# EAGLE design shield (EAGLE 9.6.2)
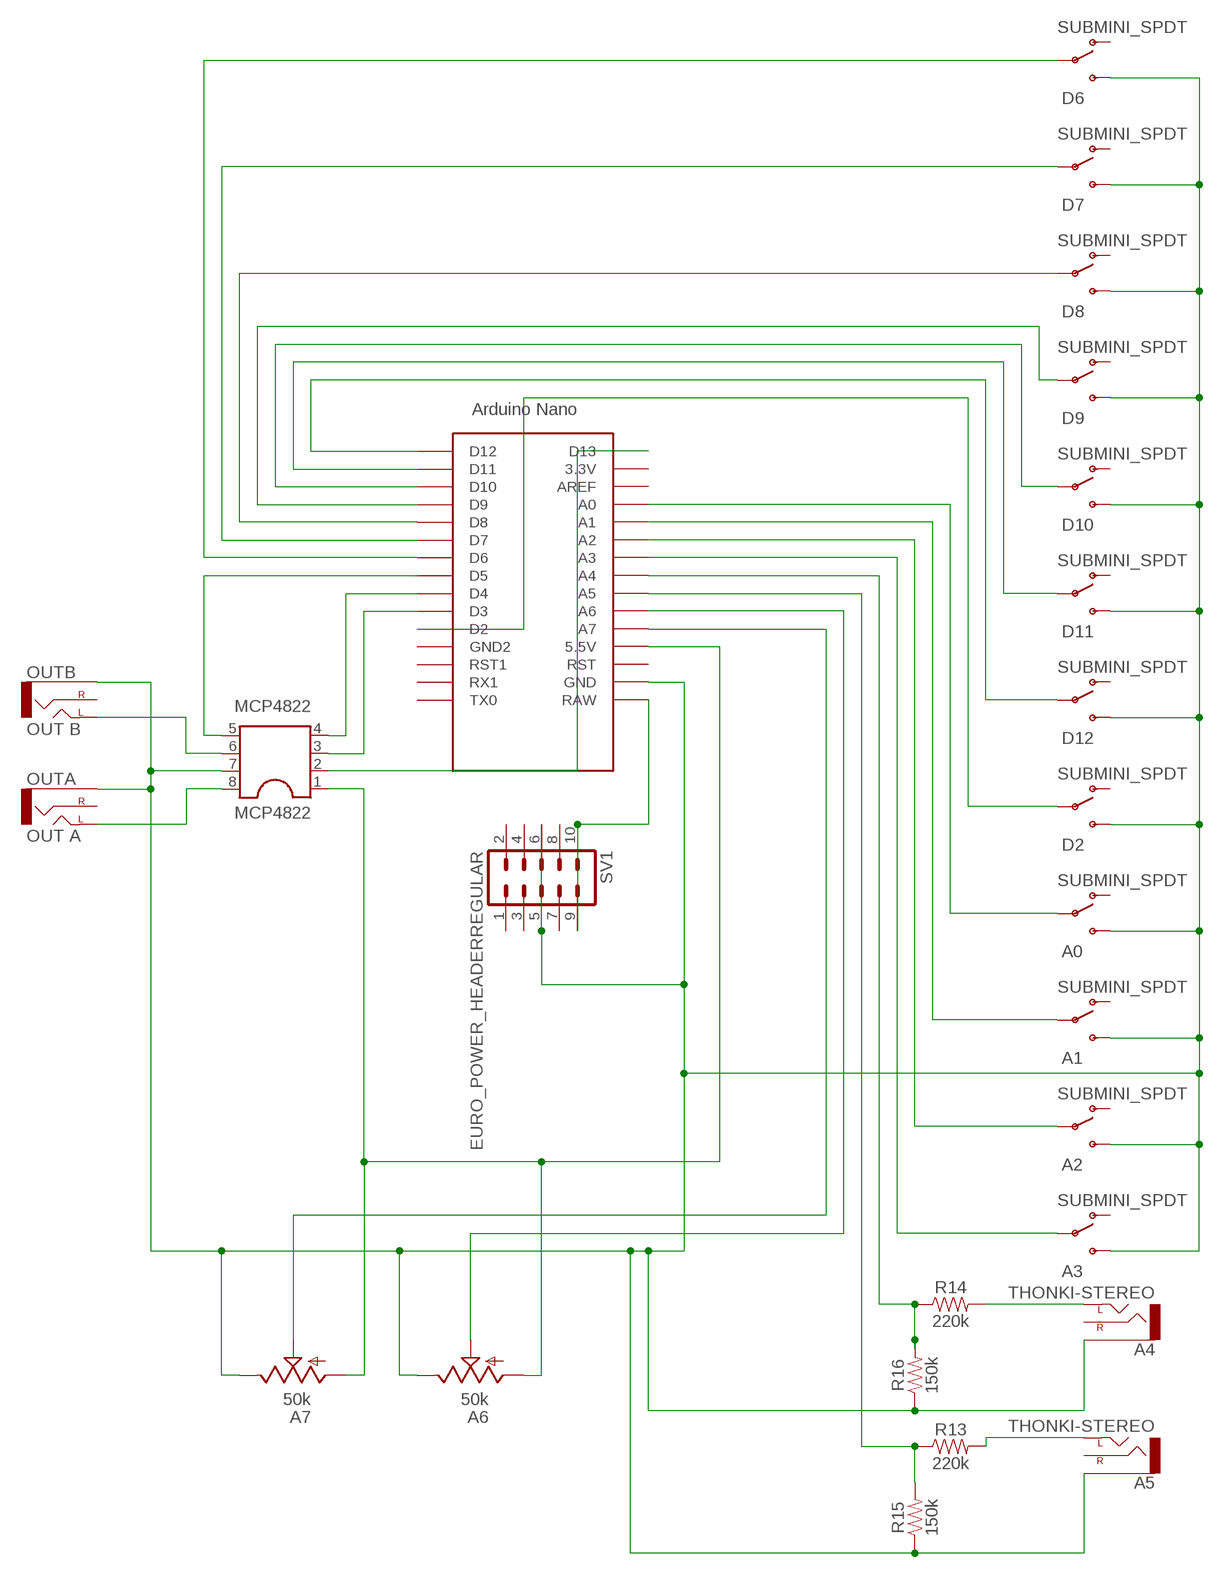
[diagram p0: schematic, sheet 1]

## Parts
A0  SUBMINI_SPDT  [SUBMINI_TOGGLE]
A1  SUBMINI_SPDT  [SUBMINI_TOGGLE]
A2  SUBMINI_SPDT  [SUBMINI_TOGGLE]
A3  SUBMINI_SPDT  [SUBMINI_TOGGLE]
A4  THONKI-STEREO  [WQP-PJ366ST_JACK]
A5  THONKI-STEREO  [WQP-PJ366ST_JACK]
A6  50k  9MM_SNAP-IN_POT_  [9MM_SNAP-IN_POT]
A7  50k  9MM_SNAP-IN_POT_  [9MM_SNAP-IN_POT]
D2  SUBMINI_SPDT  [SUBMINI_TOGGLE]
D6  SUBMINI_SPDT  [SUBMINI_TOGGLE]
D7  SUBMINI_SPDT  [SUBMINI_TOGGLE]
D8  SUBMINI_SPDT  [SUBMINI_TOGGLE]
D9  SUBMINI_SPDT  [SUBMINI_TOGGLE]
D10  SUBMINI_SPDT  [SUBMINI_TOGGLE]
D11  SUBMINI_SPDT  [SUBMINI_TOGGLE]
D12  SUBMINI_SPDT  [SUBMINI_TOGGLE]
MCP4822  MCP4822  DIL8  [DIL08]
OUTA  OUT A  THONKI-STEREO  [WQP-PJ366ST_JACK]
OUTB  OUT B  THONKI-STEREO  [WQP-PJ366ST_JACK]
R13  220k  10KOHM-HORIZ-1/4W-5%  [AXIAL-0.3]
R14  220k  10KOHM-HORIZ-1/4W-5%  [AXIAL-0.3]
R15  150k  10KOHM-HORIZ-1/4W-5%  [AXIAL-0.3]
R16  150k  10KOHM-HORIZ-1/4W-5%  [AXIAL-0.3]
SV1  EURO_POWER_HEADERREGULAR  [EURO_POWER_HEADER]
U$1  NANO  [NANO]

## Nets
N$1: SV1.9 SV1.10 U$1.RAW
N$2: A6.2(S) U$1.A6
N$3: A6.1(A) A7.1(A) MCP4822.1 U$1.5V(5.5V)
N$4: D6.COM(COMMON) U$1.D6
N$5: D7.COM(COMMON) U$1.D7
N$6: A7.2(S) U$1.A7
N$7: D9.COM(COMMON) U$1.D9
N$8: D10.COM(COMMON) U$1.D10
N$9: D11.COM(COMMON) U$1.D11
N$10: D12.COM(COMMON) U$1.D12
N$11: D2.COM(COMMON) U$1.D2
N$12: A0.COM(COMMON) U$1.A0
N$13: A1.COM(COMMON) U$1.A1
N$14: A2.COM(COMMON) U$1.A2
N$15: A3.COM(COMMON) U$1.A3
N$17: MCP4822.8 OUTA.P$1_TIP(LEFT)
N$18: MCP4822.6 OUTB.P$1_TIP(LEFT)
N$19: MCP4822.2 U$1.D13
N$20: MCP4822.3 U$1.D3
N$21: MCP4822.4 U$1.D4
N$22: MCP4822.5 U$1.D5
N$23: A0.3(S) A1.3(S) A2.3(S) A3.3(S) A4.P$3_SLEEVE(SLEEVE) A5.P$3_SLEEVE(SLEEVE) A6.3(E) A7.3(E) D2.3(S) D6.3(S) D7.3(S) D8.3(S) D9.3(S) D10.3(S) D11.3(S) D12.3(S) MCP4822.7 OUTA.P$3_SLEEVE(SLEEVE) OUTB.P$3_SLEEVE(SLEEVE) R15.P$1 R16.P$1 SV1.5 SV1.6 U$1.GND
N$24: D8.COM(COMMON) U$1.D8
N$25: A5.P$1_TIP(LEFT) R13.P$2
N$26: A4.P$1_TIP(LEFT) R14.P$2
N$29: R14.P$1 R16.P$2 U$1.A4
N$30: R13.P$1 R15.P$2 U$1.A5
Unconnected: A0.1(O) A1.1(O) A2.1(O) A3.1(O) A4.P$2_SWITCH(RIGHT) A5.P$2_SWITCH(RIGHT) D2.1(O) D6.1(O) D7.1(O) D8.1(O) D9.1(O) D10.1(O) D11.1(O) D12.1(O) OUTA.P$2_SWITCH(RIGHT) OUTB.P$2_SWITCH(RIGHT) SV1.1 SV1.2 SV1.3 SV1.4 SV1.7 SV1.8 U$1.3.3V U$1.AREF U$1.GND1(GND2) U$1.ICSP1 U$1.ICSP2 U$1.ICSP3 U$1.ICSP4 U$1.ICSP5 U$1.ICSP6 U$1.RST U$1.RST1 U$1.RX1 U$1.TX0

## Library data of the parts
A0 A1-A3 D2 D6-D12 = MusicThingModular:SUBMINI_SPDT
A4 A5 OUTA OUTB = MusicThingModular:THONKI-STEREO: 3.5mm socket for Eurorack modular synths
A6 A7 = MusicThingModular:9MM_SNAP-IN_POT: 9mm vertical snap-in pot, Alpha / Panasonic style
MCP4822 = ic-package:DIL8: Dual In Line / Socket
R13-R16 = SparkFun-Resistors:10KOHM: 10kΩ resistor A resistor is a passive two-terminal electrical component that implements electrical resistance as a circuit element. Resistors act to reduce current flow, and, at the same time, act to lower voltage levels within circuits. - Wikipedia; PROD_ID: RES-09435; VALUE: 10k
SV1 = MusicThingModular:EURO_POWER_HEADER: Power Header 10 pin power header for Eurorack Power Supplies Variants with fatter pads for easier soldering, and the LOCK variant which has 5mil offset pins to hold the component in place before soldering
U$1 = Arduino-clone:NANO: Arduino Nano

## Board
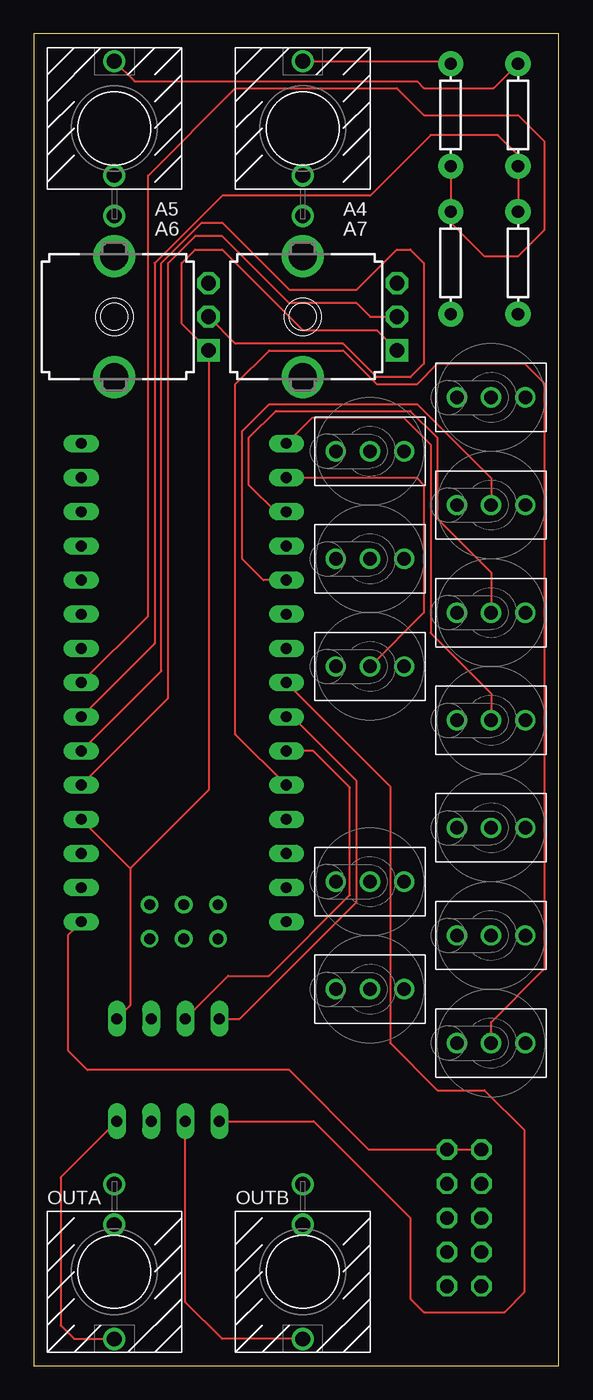
[diagram p1: board, top side]
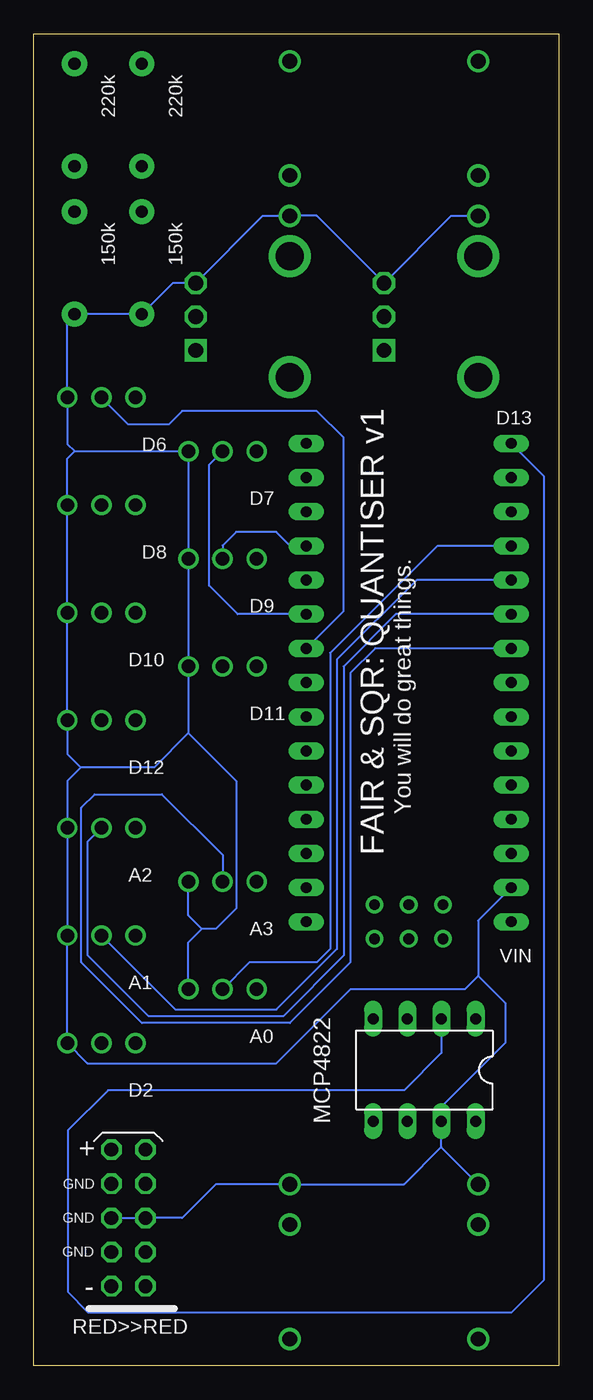
[diagram p2: board, bottom side, seen from below]

Size 39.04 x 99.05 mm. Coordinates in mm from the lower left corner, seen from the top.
Outline: 0,0 39.04,0 39.04,99.05 0,99.05 0,0
Copper layers (1*16): Top 0.035mm / dielectric 1.5mm / Bottom 0.035mm
Design rules "default": minimum track width 6mil, minimum drill 0.35mm, track to track 6mil, track to pad 6mil, pad to pad 6mil, via to via 6mil, smd to smd 6mil, copper to edge 40mil, drill to drill 6mil, minimum pad ring 10mil, minimum via ring 8mil, stop-mask expansion 4mil, vias tented up to drill 0mil, thermal gap 10mil

### Footprints (pad centres in the part's own frame; a part is rotated, then mirrored left to right if it is on the bottom)
SUBMINI_TOGGLE = drill 1 pad 1.422: 1 -2.54,0; 3 2.54,0; COM 0,0
WQP-PJ366ST_JACK = drill 1.1: P$1_TIP 0,5; P$2_SWITCH 0,-3.5; P$3_SLEEVE 0,-6.5
9MM_SNAP-IN_POT = drill 1.1 square: 1 -2.5,-7 | drill 1.1 octagon: 2 0,-7; 3 2.5,-7 | drill 2.1 pad 2.794: CHASSIS1 -4.5,0; CHASSIS2 4.5,0
DIL08 = drill 0.813 long: 1 -3.81,-3.81; 2 -1.27,-3.81; 3 1.27,-3.81; 4 3.81,-3.81; 5 3.81,3.81; 6 1.27,3.81; 7 -1.27,3.81; 8 -3.81,3.81
AXIAL-0.3 = drill 0.9 pad 1.88: P$1 -3.81,0; P$2 3.81,0
EURO_POWER_HEADER = drill 1.016 octagon: 1 -5.08,-1.27; 2 -5.08,1.27; 3 -2.54,-1.27; 4 -2.54,1.27; 5 0,-1.27; 6 0,1.27; 7 2.54,-1.27; 8 2.54,1.27; 9 5.08,-1.27; 10 5.08,1.27
NANO = drill 0.8 long: 3.3V -10.16,24.13; 5V -10.16,-1.27; A0 -10.16,19.05; A1 -10.16,16.51; A2 -10.16,13.97; A3 -10.16,11.43; A4 -10.16,8.89; A5 -10.16,6.35; A6 -10.16,3.81; A7 -10.16,1.27; AREF -10.16,21.59; D2 5.08,1.27; D3 5.08,3.81; D4 5.08,6.35; D5 5.08,8.89; D6 5.08,11.43; D7 5.08,13.97; D8 5.08,16.51; D9 5.08,19.05; D10 5.08,21.59; D11 5.08,24.13; D12 5.08,26.67; D13 -10.16,26.67; GND -10.16,-6.35; GND1 5.08,-1.27; RAW -10.16,-8.89; RST -10.16,-3.81; RST1 5.08,-3.81; RX1 5.08,-6.35; TX0 5.08,-8.89 | drill 0.8: ICSP1 -5.08,-10.16; ICSP2 -5.08,-7.62; ICSP3 -2.54,-10.16; ICSP4 -2.54,-7.62; ICSP5 0,-10.16; ICSP6 0,-7.62

### Placement (x,y rotation side)
A0  25,28 0 top
A1  34,32 0 top
A2  34,40 0 top
A3  25,36 0 top
A4  20,92 0 top
A5  6,92 0 top
A6  6,78 90 top
A7  20,78 90 top
D2  34,24 0 top
D6  34,72 0 top
D7  25,68 0 top
D8  34,64 0 top
D9  25,60 0 top
D10  34,56 0 top
D11  25,52 0 top
D12  34,48 0 top
MCP4822  10,22 180 bottom
OUTA  6,7 180 top
OUTB  20,7 180 top
R13  36,93 90 top
R14  31,93 90 top
R15  36,82 90 top
R16  31,82 90 top
SV1  32,11 90 bottom
U$1  13.7,41.91 0 top

### Tracks (layer width: path | path; a pad name or v marks a point on that pad's centre or on a via)
N$1
  Top 0.152: SV1.10 SV1.9 24.92,16.08 19,22 4,22 2.54,23.46 2.54,32.02 U$1.RAW
N$2
  Top 0.152: U$1.A6 9.5,51.68 9.5,82 12.5,85 14,85 19,80 24,80 27,83 28,83 29,82 29,74.5 28,73.5 25.5,73.5 23,76 15,76 A6.2
N$3
  Top 0.152: MCP4822.1 7.19,26.81 7.19,36.99 | 7.19,36.99 U$1.5V | 7.19,36.99 13,42.8 A6.1 11,77.5 11,82 12,83 14,83 20,77 25.5,77 A7.1
N$4
  Bottom 0.152: U$1.D6 16,56.12 16,69 18,71 28,71 29,70 32,70 D6.COM
N$5
  Bottom 0.152: U$1.D7 23.88,55.88 26,58 26,67 D7.COM
N$6
  Top 0.152: A7.2 25,78 24,79 19,79 14,84 12,84 10,82 10,49.64 U$1.A7
N$7
  Bottom 0.152: U$1.D9 19.96,60.96 21,62 24,62 25,61 D9.COM
N$8
  Top 0.152: U$1.D10 18,63.5 16,65.5 16,69 18,71 28,71 30,69 30,63 34,59 D10.COM
N$9
  Top 0.152: U$1.D11 28.46,66.04 29,65.5 29,56 D11.COM
N$10
  Top 0.152: D12.COM 34,50 29.5,54.5 29.5,68.5 27.5,70.5 20.7,70.5 U$1.D12
N$11
  Top 0.152: U$1.D2 15,46.96 15,73 17.5,75.5 23,75.5 25.5,73 28.5,73 30,74.5 36.5,74.5 37.95,73.05 37.95,29.5 34,25.55 D2.COM
N$12
  Bottom 0.152: U$1.A0 9.04,60.96 17,53 17,31 18,30 23,30 A0.COM
N$13
  Bottom 0.152: U$1.A1 10.58,58.42 16.5,52.5 16.5,31 21,26.5 28.5,26.5 A1.COM
N$14
  Bottom 0.152: U$1.A2 12.12,55.88 16,52 16,30.5 20.5,26 30.5,26 35,30.5 35,39 A2.COM
N$15
  Bottom 0.152: U$1.A3 13.66,53.34 15.5,51.5 15.5,30 20,25.5 31,25.5 35.5,30 35.5,41.5 34.5,42.5 29.5,42.5 25,38 A3.COM
N$17
  Top 0.152: MCP4822.8 2,14 2,3 3,2 OUTA.P$1_TIP
N$18
  Top 0.152: OUTB.P$1_TIP 14,2 11.27,4.73 MCP4822.6
N$19
  Bottom 0.152: MCP4822.2 8.73,23.27 11.5,20.5 33.5,20.5 36.5,17.5 36.5,5.5 35,4 3.5,4 1.09,6.41 1.09,66.13 U$1.D13
N$20
  Top 0.152: MCP4822.3 14.46,29 17.5,29 23.5,35 23.5,43 20.78,45.72 U$1.D3
N$21
  Top 0.152: MCP4822.4 15.31,25.81 24,34.5 24,43.5 19.24,48.26 U$1.D4
N$22
  Top 0.152: MCP4822.5 20.81,18.19 28,11 28,5 29,4 35,4 36.5,5.5 36.5,17.5 33.5,20.5 30,20.5 26.5,24 26.5,43.08 U$1.D5
N$23
  Bottom 0.152: 8.73,16.27 MCP4822.7 8.73,19.27 4,24 4,27 6,29 | 8.73,16.27 11.5,13.5 OUTB.P$3_SLEEVE 25.5,13.5 28,11 SV1.5 SV1.6 | OUTA.P$3_SLEEVE 8.73,16.23 8.73,16.27 | A5.P$3_SLEEVE 8,85.5 A6.3 18,85.5 A4.P$3_SLEEVE 22,85.5 A7.3 28.69,80.5 R16.P$1 R15.P$1 36.54,77.65 D6.3 36.54,68.54 36,68 | A0.3 27.54,31.5 26.54,32.5 | A3.3 27.54,33.5 26.54,32.5 | U$1.GND 6,33.1 6,29 | 36,68 D7.3 D9.3 D11.3 27.54,47.04 | 36,68 36.54,67.46 D8.3 D10.3 D12.3 36.54,45.5 35.54,44.5 | 6,29 7,28 15.5,28 21,22.5 35.04,22.5 D2.3 A1.3 A2.3 36.54,43.5 35.54,44.5 | 27.54,47.04 24,43.5 24,34 25.5,32.5 26.54,32.5 | 27.54,47.04 30.08,44.5 35.54,44.5
N$24
  Top 0.152: U$1.D8 17.08,58.42 15.5,60 15.5,69.5 17.5,71.5 28.5,71.5 34,66 D8.COM
N$25
  Top 0.152: A5.P$1_TIP 7.5,95.5 28.5,95.5 29,95 34.19,95 R13.P$2
N$26
  Top 0.152: A4.P$1_TIP 30.81,97 R14.P$2
N$29
  Top 0.152: R14.P$1 R16.P$2 31,85 33.5,82.5 36,82.5 37.95,84.45 37.95,91.05 36,93 29,93 27,95 15,95 8.5,88.5 8.5,55.76 U$1.A4
N$30
  Top 0.152: R15.P$2 R13.P$1 36,90 34.5,91.5 29.5,91.5 25,87 14,87 9,82 9,53.72 U$1.A5

### Text on the board
bNames: 220k | 220k | 150k | 150k | D13 | You will do great things. | FAIR & SQR: QUANTISER v1 | VIN